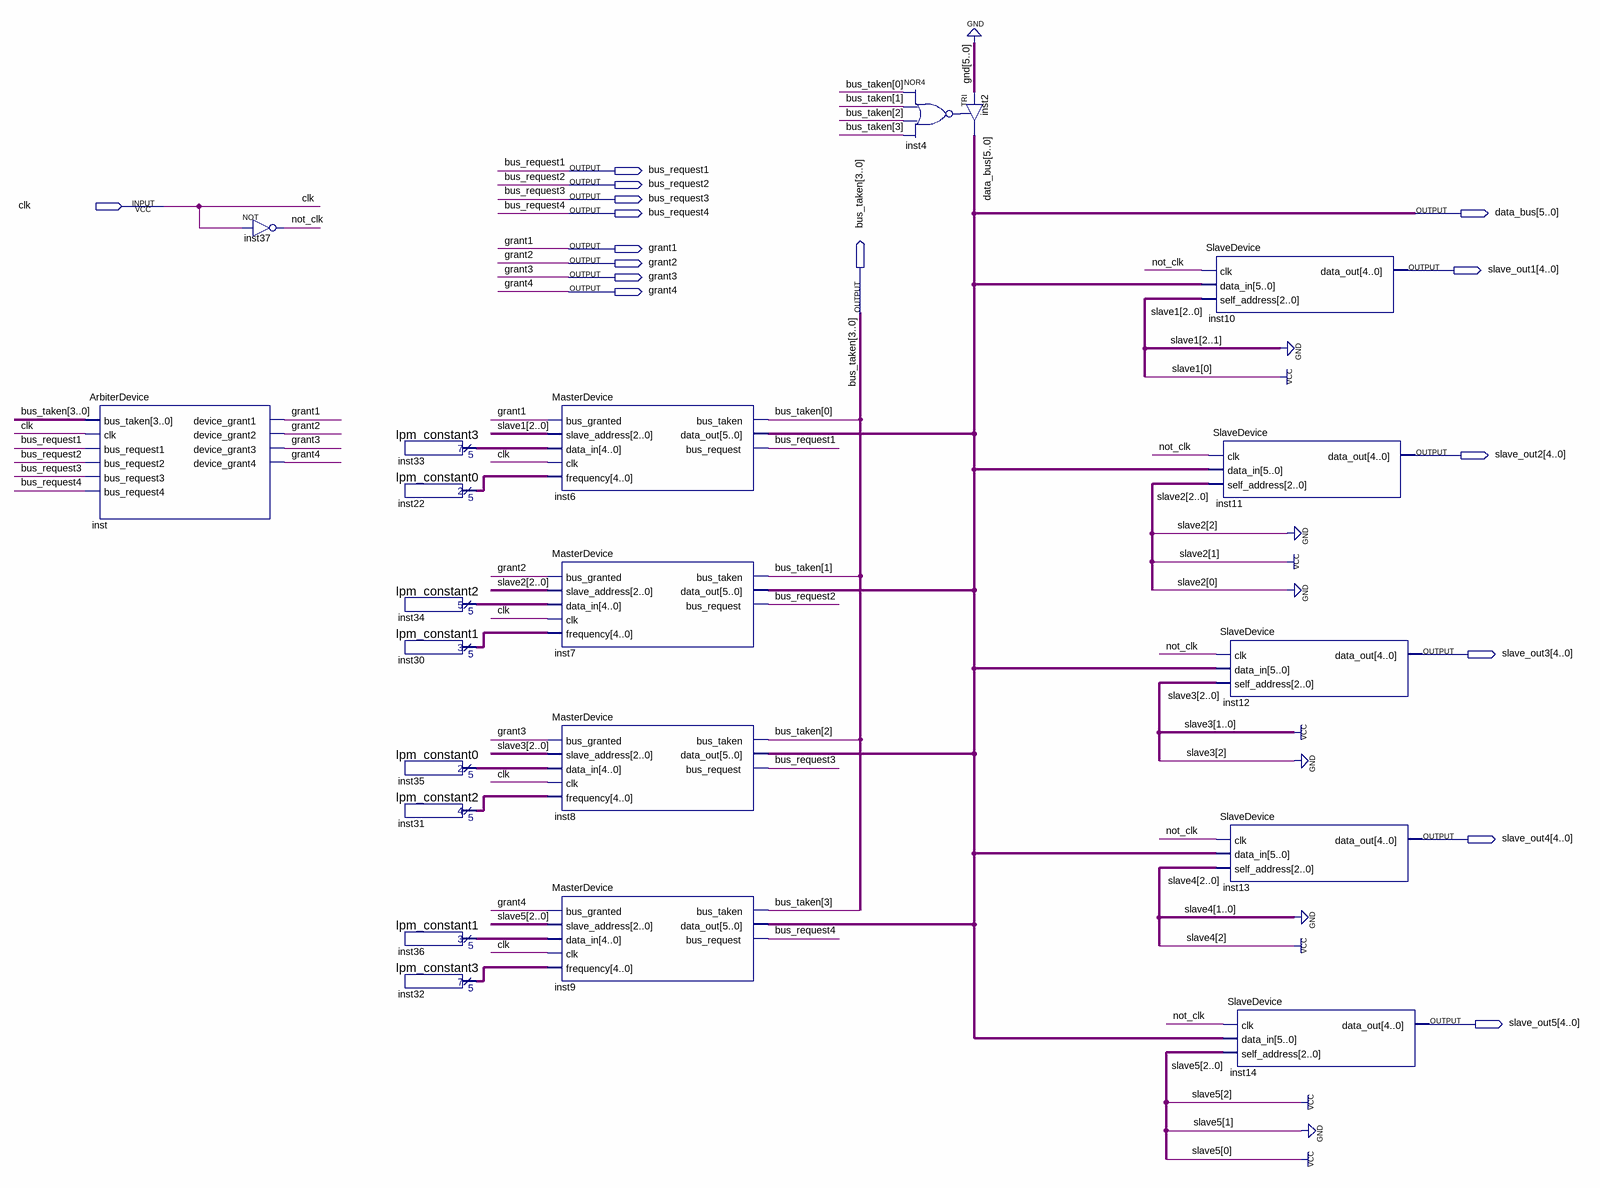
[diagram p0: schematic sheet]
// Quartus schematic Arbiter.bdf as structural Verilog: 21 symbols, 16 pins
module Arbiter (
  input  clk,
  output bus_request1,
  output bus_request2,
  output bus_request3,
  output bus_request4,
  output [5:0] data_bus,
  output grant1,
  output grant2,
  output [4:0] slave_out1,
  output grant3,
  output grant4,
  output [3:0] bus_taken,
  output [4:0] slave_out2,
  output [4:0] slave_out3,
  output [4:0] slave_out4,
  output [4:0] slave_out5
);

  wire inst4_out, not_clk;
  wire [4:0] inst22_result, inst30_result, inst31_result, inst32_result, inst33_result, inst34_result,
       inst35_result, inst36_result;

  ArbiterDevice inst (
    .bus_taken(bus_taken), .clk(clk), .bus_request1(bus_request1), .bus_request2(bus_request2),
    .bus_request3(bus_request3), .bus_request4(bus_request4), .device_grant1(grant1), .device_grant2(grant2),
    .device_grant3(grant3), .device_grant4(grant4));
  not inst37 (not_clk, clk);
  lpm_constant3 inst33 (.result(inst33_result));
  lpm_constant0 inst22 (.result(inst22_result));
  lpm_constant2 inst34 (.result(inst34_result));
  lpm_constant1 inst30 (.result(inst30_result));
  lpm_constant0 inst35 (.result(inst35_result));
  lpm_constant2 inst31 (.result(inst31_result));
  lpm_constant1 inst36 (.result(inst36_result));
  lpm_constant3 inst32 (.result(inst32_result));
  MasterDevice inst6 (
    .bus_granted(grant1), .slave_address(3'b001), .data_in(inst33_result), .clk(clk),
    .frequency(inst22_result), .bus_taken(bus_taken[0]), .data_out(data_bus), .bus_request(bus_request1));
  MasterDevice inst7 (
    .bus_granted(grant2), .slave_address(3'b010), .data_in(inst34_result), .clk(clk),
    .frequency(inst30_result), .bus_taken(bus_taken[1]), .data_out(data_bus), .bus_request(bus_request2));
  MasterDevice inst8 (
    .bus_granted(grant3), .slave_address(3'b011), .data_in(inst35_result), .clk(clk),
    .frequency(inst31_result), .bus_taken(bus_taken[2]), .data_out(data_bus), .bus_request(bus_request3));
  MasterDevice inst9 (
    .bus_granted(grant4), .slave_address(3'b101), .data_in(inst36_result), .clk(clk),
    .frequency(inst32_result), .bus_taken(bus_taken[3]), .data_out(data_bus), .bus_request(bus_request4));
  nor inst4 (inst4_out, bus_taken[0], bus_taken[1], bus_taken[2], bus_taken[3]);
  TRI inst2[5:0] (.IN({6{1'b0}}), .OE(inst4_out), .OUT(data_bus));
  SlaveDevice inst10 (.clk(not_clk), .data_in(data_bus), .self_address(3'b001), .data_out(slave_out1));
  SlaveDevice inst11 (.clk(not_clk), .data_in(data_bus), .self_address(3'b010), .data_out(slave_out2));
  SlaveDevice inst12 (.clk(not_clk), .data_in(data_bus), .self_address(3'b011), .data_out(slave_out3));
  SlaveDevice inst13 (.clk(not_clk), .data_in(data_bus), .self_address(3'b100), .data_out(slave_out4));
  SlaveDevice inst14 (.clk(not_clk), .data_in(data_bus), .self_address(3'b101), .data_out(slave_out5));
endmodule
